# EAGLE design Carte mère (EAGLE 7.2.0)
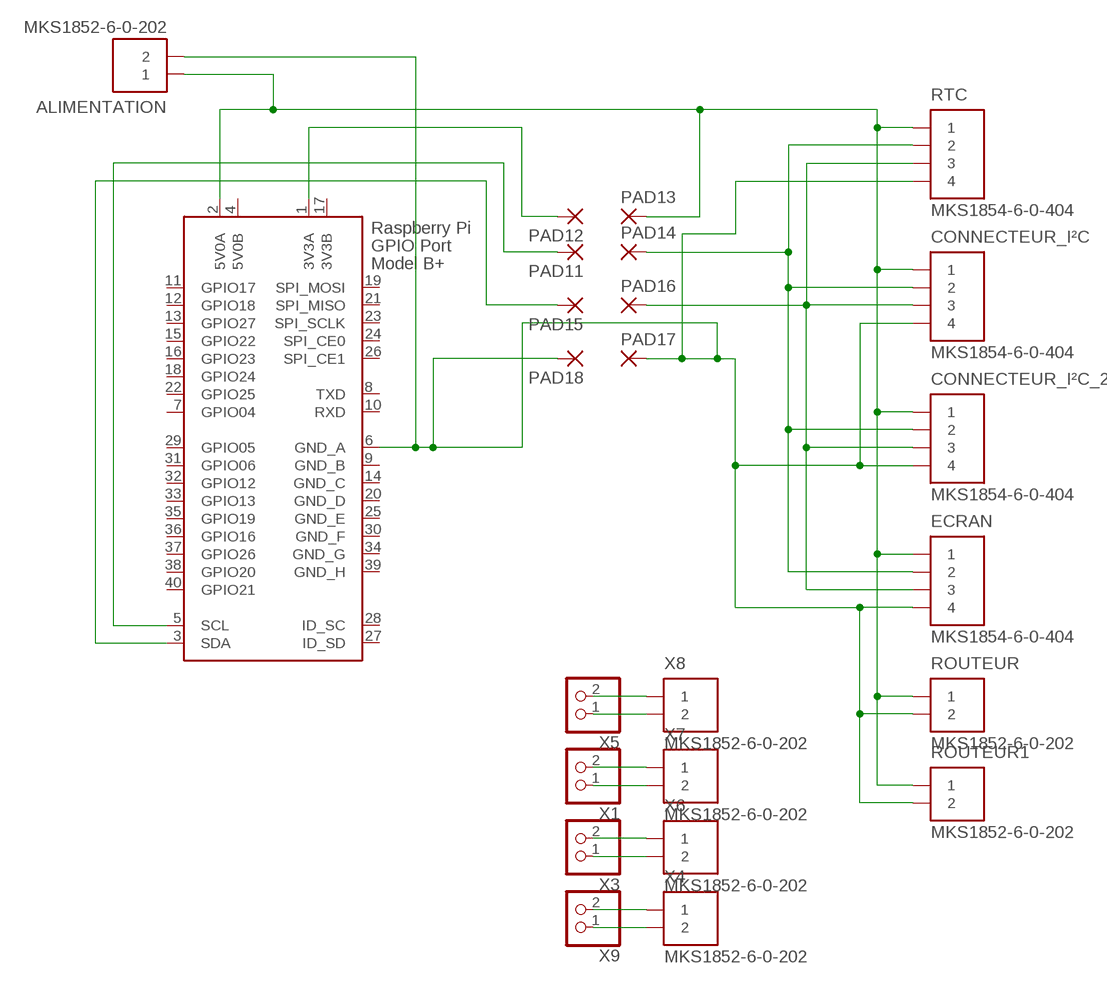
[diagram p0: schematic, sheet 1]

## Parts
ALIMENTATION  MKS1852-6-0-202  [MKS1852-6-0-202]
CONNECTEUR_I²C  MKS1854-6-0-404  [MKS1854-6-0-404]
CONNECTEUR_I²C_2  MKS1854-6-0-404  [MKS1854-6-0-404]
ECRAN  MKS1854-6-0-404  [MKS1854-6-0-404]
PAD11  1,6/0,9  [1,6/0,9]
PAD12  1,6/0,9  [1,6/0,9]
PAD13  1,6/0,9  [1,6/0,9]
PAD14  1,6/0,9  [1,6/0,9]
PAD15  1,6/0,9  [1,6/0,9]
PAD16  1,6/0,9  [1,6/0,9]
PAD17  1,6/0,9  [1,6/0,9]
PAD18  1,6/0,9  [1,6/0,9]
ROUTEUR  MKS1852-6-0-202  [MKS1852-6-0-202]
ROUTEUR1  MKS1852-6-0-202  [MKS1852-6-0-202]
RTC  MKS1854-6-0-404  [MKS1854-6-0-404]
X1  PINHD-1X2  [1X02]
X2  RASPI_GPIO_B+#_PIN  [RASPI_GPIO_B+_PIN]
X3  PINHD-1X2  [1X02]
X4  MKS1852-6-0-202  [MKS1852-6-0-202]
X5  PINHD-1X2  [1X02]
X6  MKS1852-6-0-202  [MKS1852-6-0-202]
X7  MKS1852-6-0-202  [MKS1852-6-0-202]
X8  MKS1852-6-0-202  [MKS1852-6-0-202]
X9  PINHD-1X2  [1X02]

## Nets
N$1: X5.2 X8.1
N$2: ALIMENTATION.1 CONNECTEUR_I²C.1 CONNECTEUR_I²C_2.1 ECRAN.1 PAD13.1(P) ROUTEUR1.1 ROUTEUR.1 RTC.1 X2.2(5V0A)
N$4: X5.1 X8.2
N$5: ALIMENTATION.2 CONNECTEUR_I²C.4 CONNECTEUR_I²C_2.4 ECRAN.4 PAD17.1(P) PAD18.1(P) ROUTEUR1.2 ROUTEUR.2 RTC.4 X2.6(GND_A)
N$7: X1.2 X7.1
N$8: X1.1 X7.2
N$9: X3.2 X6.1
N$10: X3.1 X6.2
N$11: X4.1 X9.2
N$12: X4.2 X9.1
N$13: PAD15.1(P) X2.3(SDA)
N$14: PAD11.1(P) X2.5(SCL)
N$15: PAD12.1(P) X2.1(3V3A)
N$16: CONNECTEUR_I²C.2 CONNECTEUR_I²C_2.2 ECRAN.2 PAD14.1(P) RTC.2
N$17: CONNECTEUR_I²C.3 CONNECTEUR_I²C_2.3 ECRAN.3 PAD16.1(P) RTC.3
Unconnected: X2.7(GPIO04) X2.8(TXD) X2.10(RXD) X2.11(GPIO17) X2.12(GPIO18) X2.13(GPIO27) X2.15(GPIO22) X2.16(GPIO23) X2.18(GPIO24) X2.19(SPI_MOSI) X2.21(SPI_MISO) X2.22(GPIO25) X2.23(SPI_SCLK) X2.24(SPI_CE0) X2.26(SPI_CE1) X2.27(ID_SD) X2.28(ID_SC) X2.29(GPIO05) X2.31(GPIO06) X2.32(GPIO12) X2.33(GPIO13) X2.35(GPIO19) X2.36(GPIO16) X2.37(GPIO26) X2.38(GPIO20) X2.40(GPIO21)

## Power pins joined to a net without a drawn wire
3V3B: X2.17(3V3B)
5V0B: X2.4(5V0B)
GND_B: X2.9(GND_B)
GND_C: X2.14(GND_C)
GND_D: X2.20(GND_D)
GND_E: X2.25(GND_E)
GND_F: X2.30(GND_F)
GND_G: X2.34(GND_G)
GND_H: X2.39(GND_H)

## Library data of the parts
ALIMENTATION ROUTEUR ROUTEUR1 X4 X6-X8 = con-stocko:MKS1852-6-0-202: Serie MKS 1850 Lötstifte In-line, Raster 2.5 mm, Stiftwannen, stehend, mit Rastlasche Source: http://www.stocko.de/de/index.php?seite=ka_rfk2_mks1850.html&rubrik=Katalog+-+RFK+2 rfk_1850.pdf; OC_FARNELL: unknown; OC_NEWARK: unknown
CONNECTEUR_I²C CONNECTEUR_I²C_2 ECRAN RTC = con-stocko:MKS1854-6-0-404: Serie MKS 1850 Lötstifte In-line, Raster 2.5 mm, Stiftwannen, stehend, mit Rastlasche Source: http://www.stocko.de/de/index.php?seite=ka_rfk2_mks1850.html&rubrik=Katalog+-+RFK+2 rfk_1850.pdf; OC_FARNELL: 1141862; OC_NEWARK: unknown
PAD11-PAD18 = wirepad:1,6/0,9: THROUGH-HOLE PAD
X1 X3 X5 X9 = pinhead:PINHD-1X2: PIN HEADER
X2 = raspberrypi_Bastelstube_v13:RASPI_GPIO_B+#: 2x20 header connector, all pins connected

## Net classes
0 default: width 1 mm

## Board
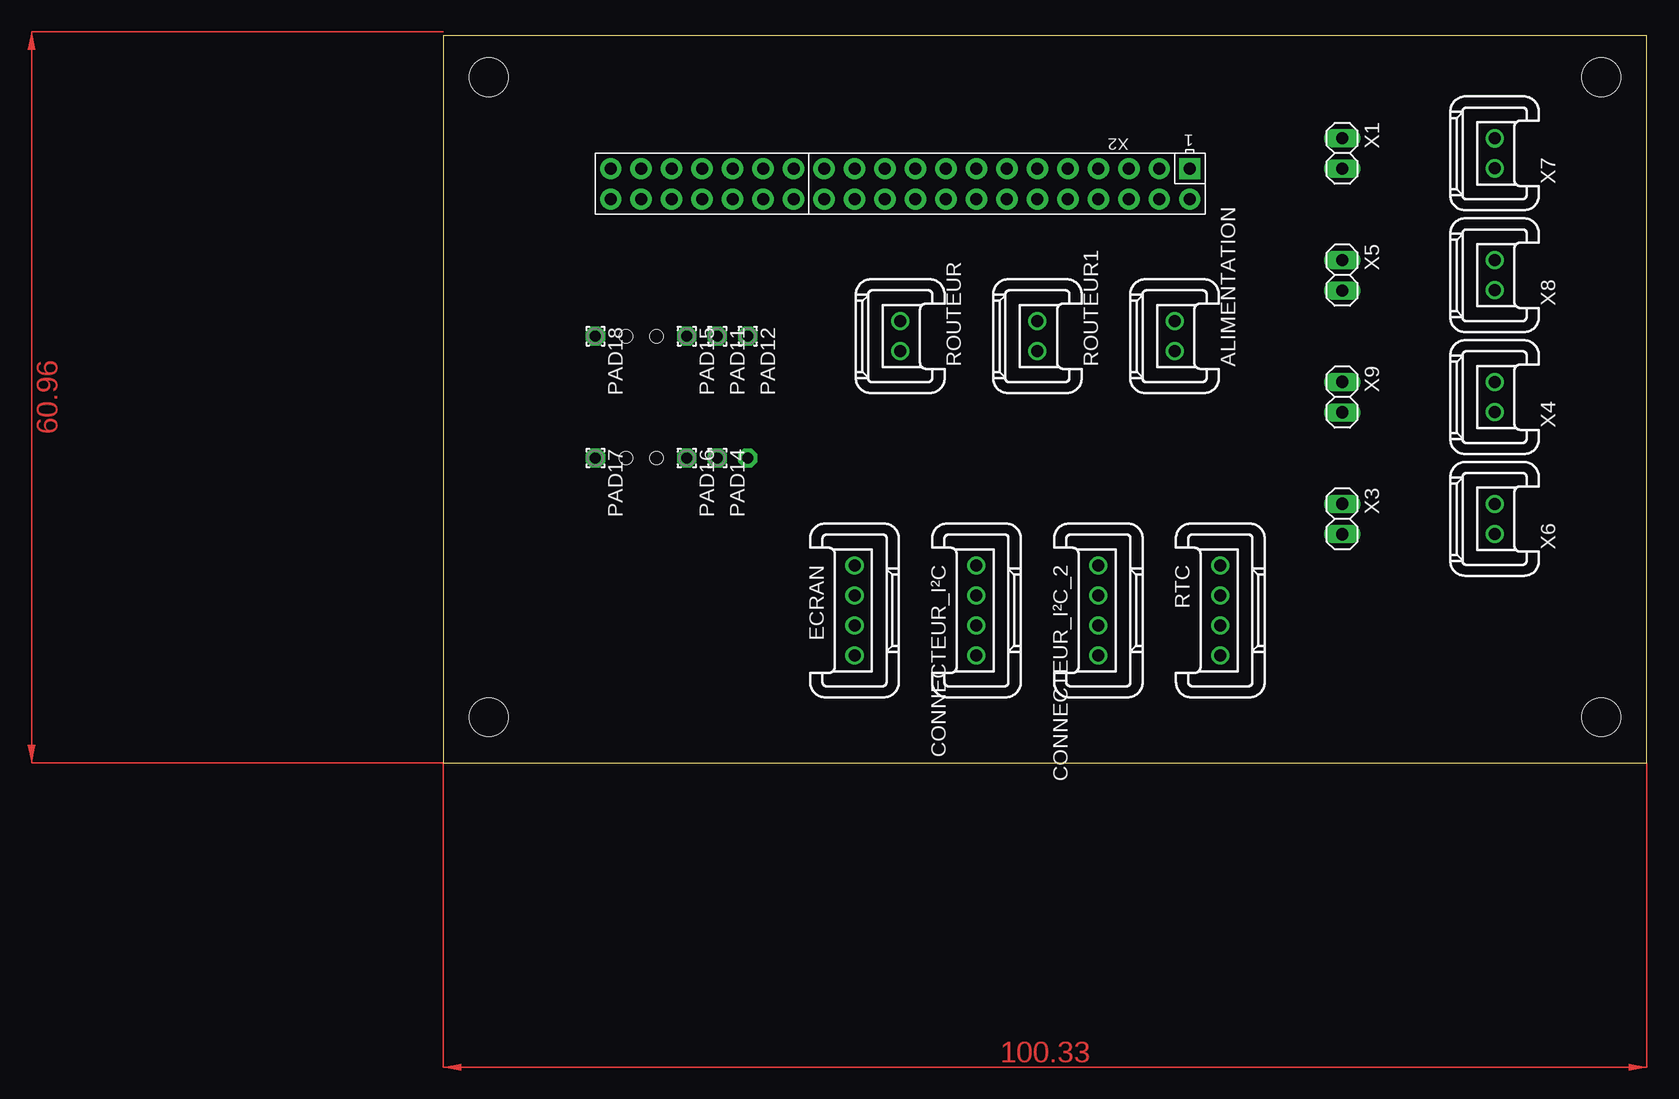
[diagram p1: board, top side]
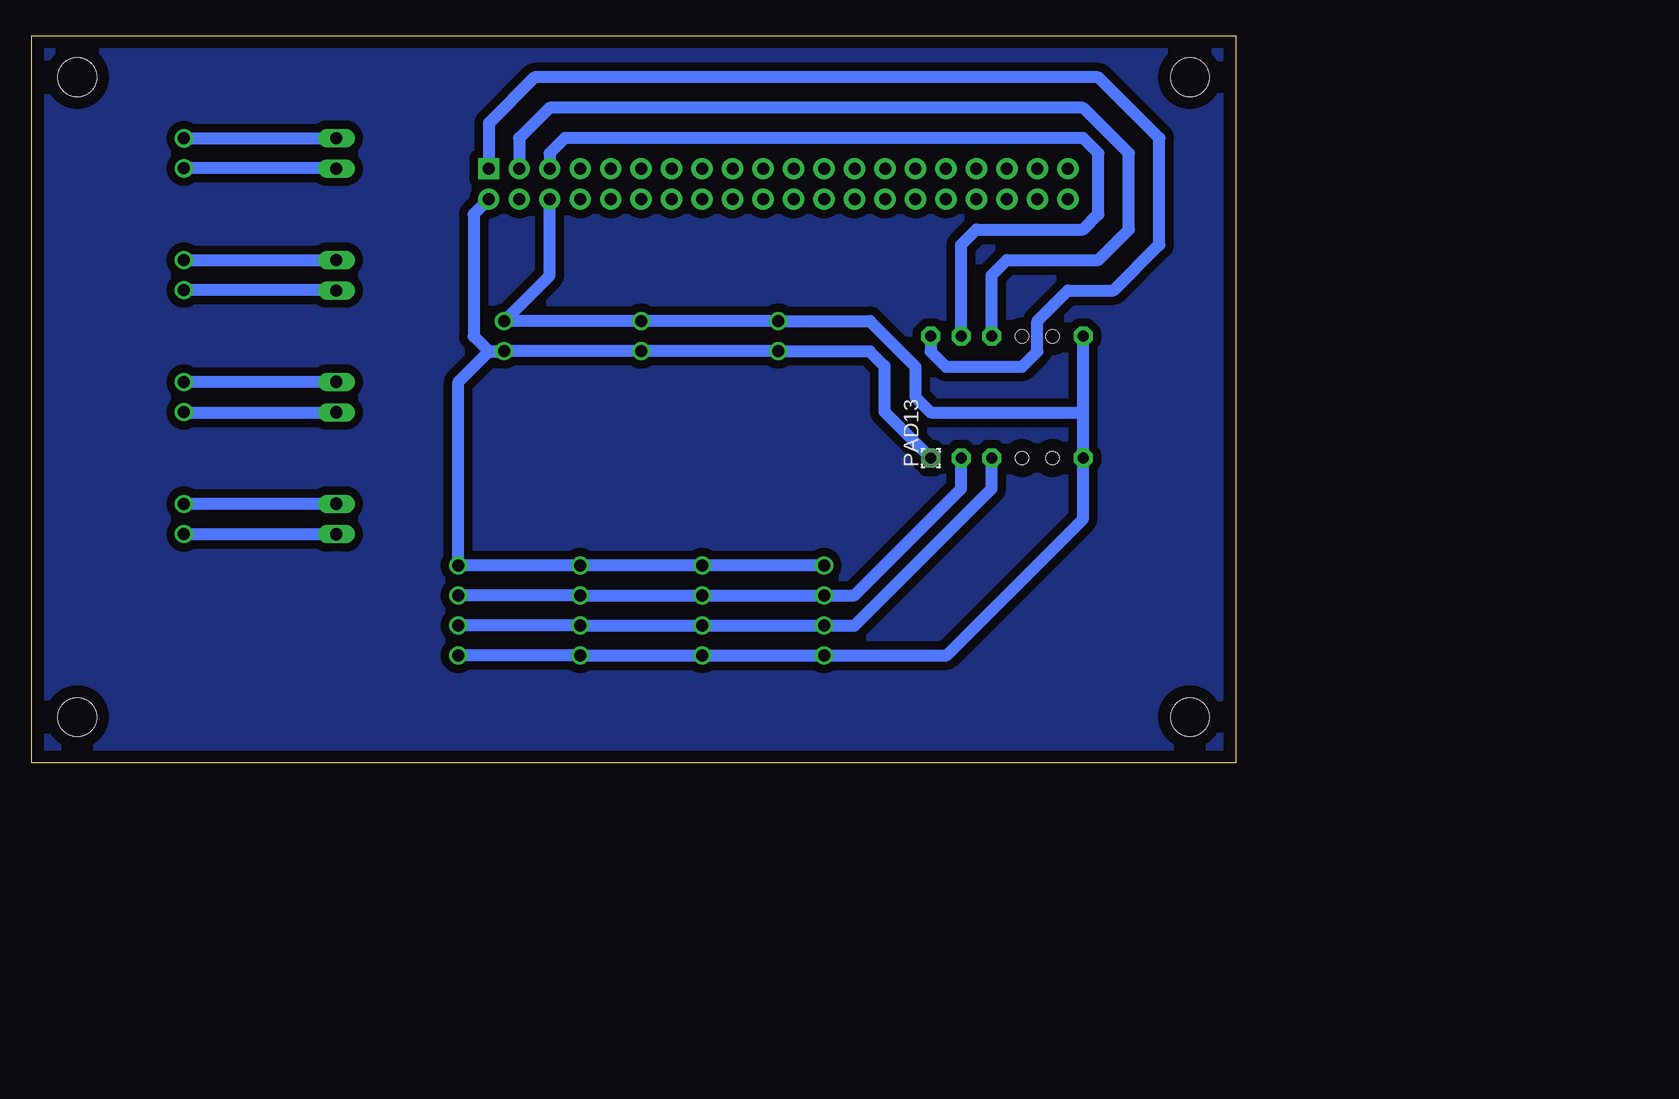
[diagram p2: board, bottom side, seen from below]

Size 100.31 x 60.63 mm. Coordinates in mm from the lower left corner, seen from the top.
Outline: 0,0 100.31,0 100.31,60.63 0,60.63 0,0
Copper layers (1*16): Top 0.035mm / dielectric 1.5mm / Bottom 0.035mm
Design rules "default": minimum track width 10mil, minimum drill 24mil, track to track 8mil, track to pad 8mil, pad to pad 8mil, via to via 8mil, smd to smd 8mil, copper to edge 40mil, drill to drill 8mil, minimum pad ring 10mil, minimum via ring 8mil, stop-mask expansion 4mil, vias tented up to drill 0mil, thermal gap 10mil
Holes 3.2 mm at 96.52,3.81 96.52,57.15 3.81,57.15 3.81,3.81
Holes 1.1 mm at 15.24,35.56 17.78,35.56 17.78,25.4 15.24,25.4

### Footprints (pad centres in the part's own frame; a part is rotated, then mirrored left to right if it is on the bottom)
MKS1852-6-0-202 = drill 1 pad 1.422: 1 -1.25,0; 2 1.25,0
MKS1854-6-0-404 = drill 1 pad 1.422: 1 -3.75,0; 2 -1.25,0; 3 1.25,0; 4 3.75,0
1,6/0,9 = drill 0.914 pad 1.6 octagon: 1 0,0
1X02 = drill 1.016 long: 1 -1.27,0; 2 1.27,0
RASPI_GPIO_B+_PIN = drill 1 pad 1.778 square: 1 -24.13,-1.27 | drill 1 pad 1.778: 2 -24.13,1.27; 3 -21.59,-1.27; 4 -21.59,1.27; 5 -19.05,-1.27; 6 -19.05,1.27; 7 -16.51,-1.27; 8 -16.51,1.27; 9 -13.97,-1.27; 10 -13.97,1.27; 11 -11.43,-1.27; 12 -11.43,1.27; 13 -8.89,-1.27; 14 -8.89,1.27; 15 -6.35,-1.27; 16 -6.35,1.27; 17 -3.81,-1.27; 18 -3.81,1.27; 19 -1.27,-1.27; 20 -1.27,1.27; 21 1.27,-1.27; 22 1.27,1.27; 23 3.81,-1.27; 24 3.81,1.27; 25 6.35,-1.27; 26 6.35,1.27; 27 8.89,-1.27; 28 8.89,1.27; 29 11.43,-1.27; 30 11.43,1.27; 31 13.97,-1.27; 32 13.97,1.27; 33 16.51,-1.27; 34 16.51,1.27; 35 19.05,-1.27; 36 19.05,1.27; 37 21.59,-1.27; 38 21.59,1.27; 39 24.13,-1.27; 40 24.13,1.27

### Placement (x,y rotation side)
ALIMENTATION  60.96,35.56 90 top
CONNECTEUR_I²C  44.45,12.7 270 top
CONNECTEUR_I²C_2  54.61,12.7 270 top
ECRAN  34.29,12.7 270 top
PAD11  22.86,35.56 270 top
PAD12  25.4,35.56 270 top
PAD13  25.4,25.4 90 bottom
PAD14  22.86,25.4 270 top
PAD15  20.32,35.56 270 top
PAD16  20.32,25.4 270 top
PAD17  12.7,25.4 270 top
PAD18  12.7,35.56 270 top
ROUTEUR  38.1,35.56 90 top
ROUTEUR1  49.53,35.56 90 top
RTC  64.77,12.7 270 top
X1  74.93,50.8 270 top
X2  38.1,48.26 180 top
X3  74.93,20.32 270 top
X4  87.63,30.48 90 top
X5  74.93,40.64 270 top
X6  87.63,20.32 90 top
X7  87.63,50.8 90 top
X8  87.63,40.64 90 top
X9  74.93,30.48 270 top

### Tracks (layer width: path | path; a pad name or v marks a point on that pad's centre or on a via)
N$1
  Bottom 1: X5.2 74.95,39.39 X8.1
N$2
  Bottom 1: ALIMENTATION.1 ROUTEUR1.1 ROUTEUR.1 38.08,34.29 30.48,34.29 29.27,33.08 29.27,29.27 PAD13.1 | X2.2 63.5,45.72 63.5,35.56 62.25,34.31 ALIMENTATION.1 | ALIMENTATION.1 60.98,34.29 62.23,34.29 64.77,31.75 RTC.1 CONNECTEUR_I²C_2.1 CONNECTEUR_I²C.1 ECRAN.1
N$3
  pour Bottom (isolate 0.7): 0,60.96 0,0 100.33,0 100.33,60.96
N$4
  Bottom 1: X8.2 87.61,41.91 X5.1
N$5
  Bottom 1: RTC.4 CONNECTEUR_I²C_2.4 CONNECTEUR_I²C.4 ECRAN.4 24.07,8.95 12.7,20.32 PAD17.1 12.7,29.21 | 12.7,29.21 PAD18.1 | X2.6 57.15,40.62 ALIMENTATION.2 ROUTEUR1.2 ROUTEUR.2 38.08,36.83 30.48,36.83 26.67,33.02 26.67,30.48 25.4,29.21 12.7,29.21
N$6
  Bottom 0.8: 3.81,5.08 3.81,2.54
N$7
  Bottom 1: X1.2 74.95,49.55 X7.1
N$8
  Bottom 1: X7.2 87.61,52.07 X1.1
N$9
  Bottom 1: X6.1 87.61,19.05 X3.2
N$10
  Bottom 1: X3.1 74.95,21.57 X6.2
N$11
  Bottom 1: X4.1 87.61,29.21 X9.2
N$12
  Bottom 1: X9.1 74.95,31.73 X4.2
N$13
  Bottom 1: PAD15.1 20.32,40.64 19.05,41.91 11.43,41.91 8.89,44.45 8.89,50.8 12.7,54.61 57.15,54.61 59.69,52.07 X2.3
N$14
  Bottom 1: PAD11.1 22.86,43.18 21.59,44.45 12.7,44.45 11.43,45.72 11.43,50.8 12.7,52.07 55.88,52.07 57.15,50.8 X2.5
N$15
  Bottom 1: PAD12.1 25.4,34.29 24.13,33.02 17.78,33.02 16.51,34.29 16.51,36.83 13.97,39.37 10.16,39.37 6.35,43.18 6.35,52.07 11.43,57.15 58.42,57.15 62.23,53.34 X2.1
N$16
  Bottom 1: RTC.2 CONNECTEUR_I²C_2.2 CONNECTEUR_I²C.2 ECRAN.2 31.77,13.95 22.86,22.86 PAD14.1
N$17
  Bottom 1: RTC.3 CONNECTEUR_I²C_2.3 CONNECTEUR_I²C.3 ECRAN.3 31.77,11.45 31.75,11.43 20.32,22.86 PAD16.1
N$18
  Bottom 0.8: 2.54,3.81 5.08,3.81
N$19
  Bottom 0.8: 2.54,57.15 3.81,57.15 | 5.08,57.15 3.81,57.15 | 3.81,57.15 3.81,58.42 | 3.81,57.15 3.81,55.88
N$20
  Bottom 0.8: 95.25,57.15 96.52,57.15 | 97.79,57.15 96.52,57.15 | 96.52,57.15 96.52,58.42 | 96.52,57.15 96.52,55.88
N$21
  Bottom 0.8: 95.25,3.81 96.52,3.81 | 97.79,3.81 96.52,3.81 | 96.52,3.81 96.52,5.08 | 96.52,3.81 96.52,2.54
(copper drawn outside any net)
  shapes: Top area x2